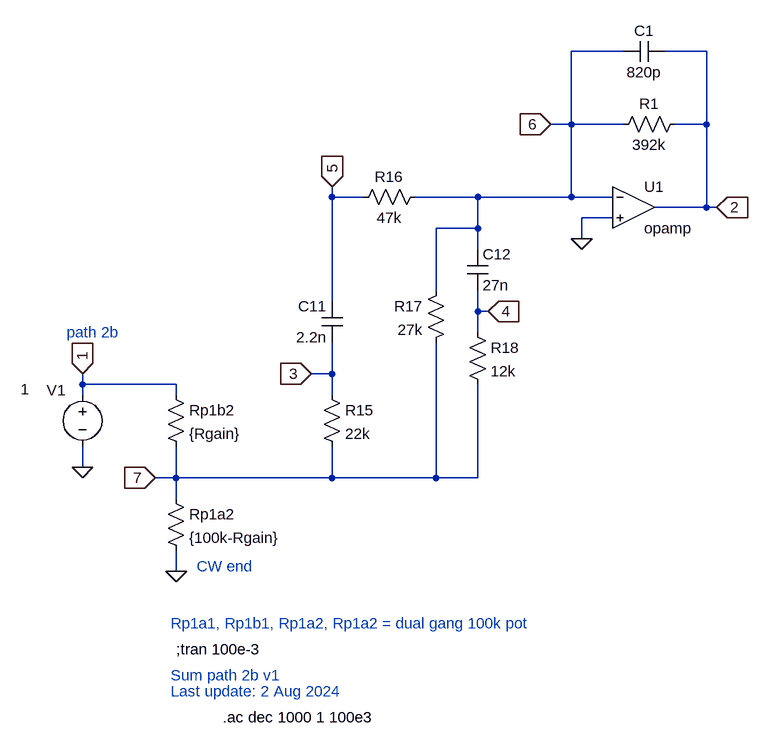
[diagram p0: schematic Klon-Centaur_sum_path2b_v1.asc]
Klon-Centaur_sum_path2b_v1.asc, the LTspice schematic file:
Version 4
SHEET 1 4496 5064
WIRE 432 2160 352 2160
WIRE 560 2160 496 2160
WIRE 352 2272 352 2160
WIRE 352 2272 320 2272
WIRE 432 2272 352 2272
WIRE 560 2272 560 2160
WIRE 560 2272 512 2272
WIRE -16 2384 -16 2368
WIRE 32 2384 -16 2384
WIRE 208 2384 112 2384
WIRE 352 2384 352 2272
WIRE 352 2384 208 2384
WIRE 416 2384 352 2384
WIRE 560 2400 560 2272
WIRE 560 2400 480 2400
WIRE 576 2400 560 2400
WIRE 416 2416 368 2416
WIRE 208 2432 208 2384
WIRE 208 2432 144 2432
WIRE 368 2448 368 2416
WIRE 208 2464 208 2432
WIRE 144 2528 144 2432
WIRE -16 2544 -16 2384
WIRE 208 2560 208 2528
WIRE 224 2560 208 2560
WIRE 208 2592 208 2560
WIRE -16 2656 -16 2608
WIRE -16 2656 -48 2656
WIRE -400 2672 -400 2656
WIRE -256 2672 -400 2672
WIRE -400 2688 -400 2672
WIRE -256 2688 -256 2672
WIRE -16 2688 -16 2656
WIRE -400 2800 -400 2768
WIRE -256 2816 -256 2768
WIRE -256 2816 -288 2816
WIRE -16 2816 -16 2768
WIRE -16 2816 -256 2816
WIRE 144 2816 144 2608
WIRE 144 2816 -16 2816
WIRE 208 2816 208 2672
WIRE 208 2816 144 2816
WIRE -256 2848 -256 2816
WIRE -256 2960 -256 2928
FLAG -16 2368 5
IOPIN -16 2368 In
FLAG -48 2656 3
IOPIN -48 2656 In
FLAG 224 2560 4
IOPIN 224 2560 In
FLAG -400 2656 1
IOPIN -400 2656 In
FLAG -400 2800 0
FLAG 576 2400 2
IOPIN 576 2400 In
FLAG 320 2272 6
IOPIN 320 2272 In
FLAG 368 2448 0
FLAG -288 2816 7
IOPIN -288 2816 In
FLAG -256 2960 0
SYMBOL cap 0 2544 M0
SYMATTR InstName C11
SYMATTR Value 2.2n
SYMBOL res -32 2672 R0
SYMATTR InstName R15
SYMATTR Value 22k
SYMBOL res 160 2512 M0
SYMATTR InstName R17
SYMATTR Value 27k
SYMBOL res 192 2576 R0
SYMATTR InstName R18
SYMATTR Value 12k
SYMBOL cap 192 2464 R0
SYMATTR InstName C12
SYMATTR Value 27n
SYMBOL res 128 2368 R90
WINDOW 0 0 56 VBottom 2
WINDOW 3 32 56 VTop 2
SYMATTR InstName R16
SYMATTR Value 47k
SYMBOL voltage -400 2672 R0
WINDOW 0 -55 9 Left 2
WINDOW 39 0 0 Left 0
WINDOW 3 -95 8 Left 2
SYMATTR InstName V1
SYMATTR Value 1
SYMATTR Value2 AC 1 0
SYMBOL res 528 2256 R90
WINDOW 0 0 56 VBottom 2
WINDOW 3 32 56 VTop 2
SYMATTR InstName R1
SYMATTR Value 392k
SYMBOL cap 496 2144 R90
WINDOW 0 0 32 VBottom 2
WINDOW 3 32 32 VTop 2
SYMATTR InstName C1
SYMATTR Value 820p
SYMBOL OpAmps\\opamp 448 2336 R0
SYMATTR InstName U1
SYMBOL res -272 2672 R0
SYMATTR InstName Rp1b2
SYMATTR Value {Rgain}
SYMBOL res -272 2832 R0
SYMATTR InstName Rp1a2
SYMATTR Value {100k-Rgain}
TEXT -184 3184 Left 2 !.ac dec 1000 1 100e3
TEXT -256 3080 Left 2 !;tran 100e-3
TEXT -264 3120 Left 2 ;Sum path 2b v1
TEXT -424 2592 Left 2 ;path 2b
TEXT -264 3144 Left 2 ;Last update: 2 Aug 2024
TEXT -224 2952 Left 2 ;CW end
TEXT -264 3040 Left 2 ;Rp1a1, Rp1b1, Rp1a2, Rp1a2 = dual gang 100k pot

The netlist it stands for:
* Klon-Centaur_sum_path2b_v1.asc
C11 5 3 2.2n
R15 3 7 22k
R17 6 7 27k
R18 4 7 12k
C12 6 4 27n
R16 6 5 47k
V1 1 0 1 AC 1 0
R1 2 6 392k
C1 2 6 820p
XU1 6 0 2 opamp Aol=100K GBW=10Meg  ; pins invin noninvin out
Rp1b2 1 7 {Rgain}
Rp1a2 7 0 {100k-Rgain}
.ac dec 1000 1 100e3
;tran 100e-3
* Sum path 2b v1
* path 2b
* Last update: 2 Aug 2024
* CW end
* Rp1a1, Rp1b1, Rp1a2, Rp1a2 = dual gang 100k pot
.backanno
.end